# EAGLE schematic MCAT-4CU-B-PPU-V7x-7V2 (EAGLE 6.5.0)
Plasma Power Unit (PPU) V7x [Redrawn from mCAT-V7.pdf] Schematic Version: 1 Date: 8/29/2013 Author: Samudra Haque G19124781 samudra@gwu.edu Project: Micro-Cathode Arc Thruster PhoneSat Experiment Department: Mechanical and Aerospace Engineering (Micropropulsion and Nanotechnology Laboratory) This circuit builds upon the Taisen V7 mCAT with modifications to supply rails and operation with MCAT-3CU-PS3 subsystem. [Note] PPU(V7x) = PPU V7, as-is with conductive polymer aluminum solid capacitor replacement for C1 PPU(V7.2) = PPU V7x, with conductive polymer aluminum solid capactior as replacement for C1, and omission of with RS1, RS2, R1, R4 until further investigation and Switched P15H, Switched P15L, Common Ground operation PPU(V8.1) = Proposed PPU schematic with new IGBT pre-driver (FAN3227TMX); upgraded IGBT protection circuit using fast diodes with high reverse characteristics; current monitoring sensor; modular PCB design TBD
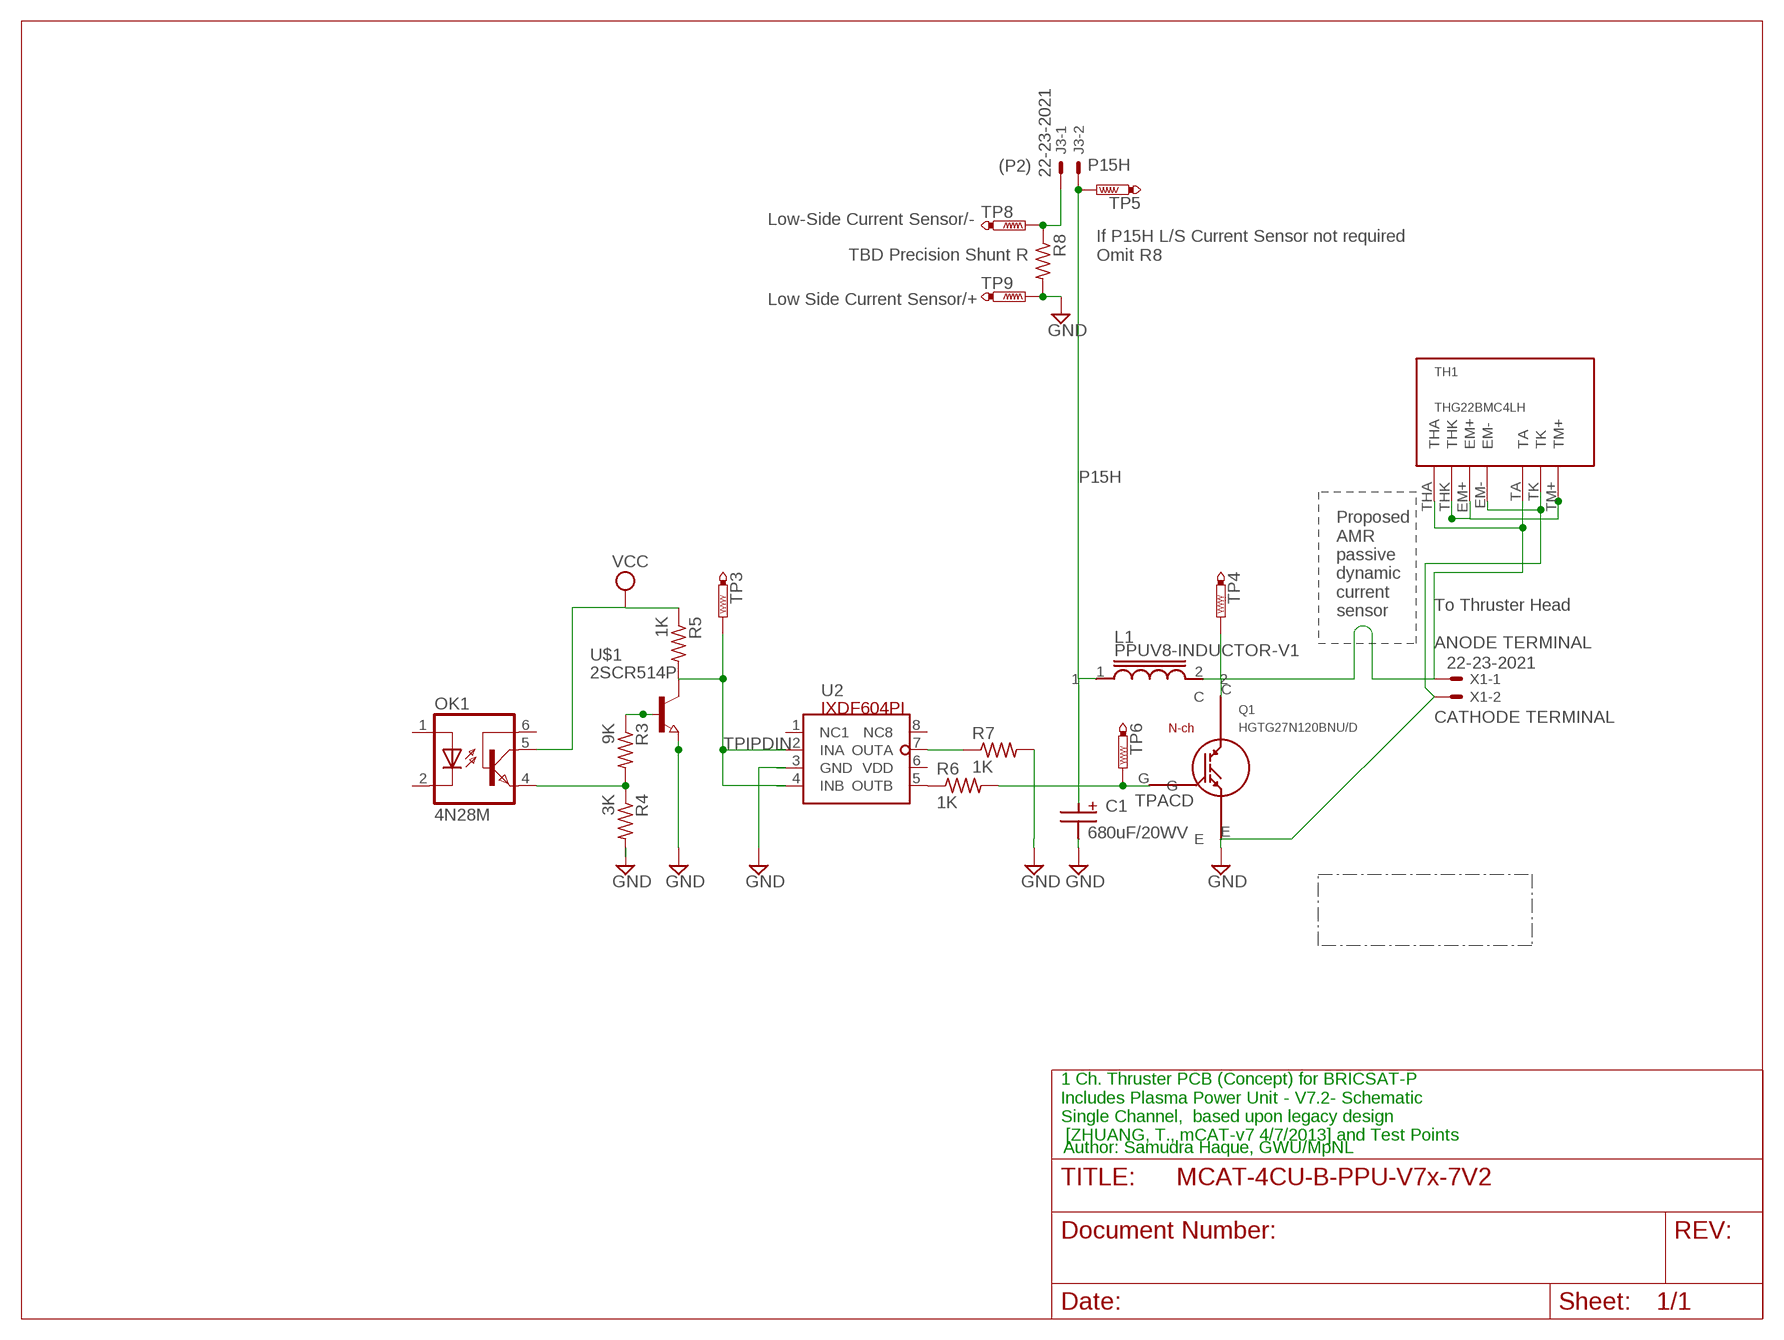
[diagram p0: schematic, sheet 1]

## Parts
C1  680uF/20WV  APSG200ELL681MJB5S  [CHEMI-CON-PSG-JB5]
J3  22-23-2021  [22-23-2021]
L1  PPUV8-INDUCTOR-V1  [PPUV8-INDUCTOR-V1]
OK1  4N28M  [DIL06]
Q1  HGTG27N120BNU/D  [TO-247-FLAT-UD]
R3  9K  R-US_0204/2V  [0204V]
R4  3K  R-US_0204/2V  [0204V]
R5  1K  R-US_0204/2V  [0204V]
R6  1K  R-US_0204/2V  [0204V]
R7  1K  R-US_0204/2V  [0204V]
R8  TBD Precision Shunt R  R-US_0204/2V  [0204V]
TH1  THG22BMC4LH  [TH-G22BMC4-LH]
TP3  PTR1PAD1-20  [P1-20]
TP4  PTR1PAD1-20  [P1-20]
TP5  PTR1PAD1-20  [P1-20]
TP6  PTR1PAD1-20  [P1-20]
TP8  PTR1PAD1-20  [P1-20]
TP9  PTR1PAD1-20  [P1-20]
U2  IXDF604PI  [DIL08]
U$1  2SCR514P  [SOT-89]
X1  22-23-2021  [22-23-2021]

## Nets
GND: C1.NEG(CAP_NEG) Q1.E R4.2 R8.2 TH1.EM- TP9.TP U2.3(GND) U$1.3(E) X1.2
N$1: TH1.EM+ TH1.THK TH1.TM+
N$6: OK1.4(EMI) R3.2 R4.1
N$7: R3.1 U$1.1(B)
N$8: R6.1 U2.5(OUTB)
N$9: R7.1 U2.7(OUTA)
N$10: R7.2
N$12: J3.1 R8.1 TP8.TP
N$13 [V_DC]: L1.2 Q1.C TH1.TA TH1.THA TP4.TP X1.1
P15H: C1.POS(CAP_POS) J3.2 L1.1 TP5.TP
TPACD: Q1.G R6.2 TP6.TP
TPIPDIN: R5.2 TP3.TP U2.2(INA) U2.4(INB) U$1.2(C) U$1.2@1(C)
VCC: OK1.5(COL) R5.1
Unconnected: OK1.1(A) OK1.2(C) OK1.6(BAS) TH1.TK U2.1(NC1) U2.6(VDD) U2.8(NC8)

## Notes on the sheet
- (P2)
- P15H
- Low-Side Current Sensor/-
- If P15H L/S Current Sensor not required
  Omit R8
- Low Side Current Sensor/+
- Proposed
  AMR
  passive
  dynamic
  current
  sensor
- To Thruster Head
  
  ANODE TERMINAL
  
  
  
  CATHODE TERMINAL
- 1 Ch. Thruster PCB (Concept) for BRICSAT-P
  Includes Plasma Power Unit - V7.2- Schematic 
  Single Channel,  based upon legacy design
   [ZHUANG, T., mCAT-v7 4/7/2013] and Test Points
- Author: Samudra Haque, GWU/MpNL

## Library data of the parts
C1 = gwu_mpnl:APSG200ELL681MJB5S
J3 X1 = con-molex:22-23-2021: .100" (2.54mm) Center Header - 2 Pin; MF: MOLEX; MPN: 22-23-2021; OC_FARNELL: 1462926; OC_NEWARK: 25C3832
L1 = gwu_mpnl:PPUV8-INDUCTOR-V1
OK1 = optocoupler:4N*?M: General Purpose 6-Pin Phototransistor Optocouplers Source: http://www.fairchildsemi.com/ds/4N/4N35-M.pdf; MF: FAIRCHILD SEMICONDUCTOR; MPN: 4N28-M; OC_FARNELL: 1504445; OC_NEWARK: 05C3313
Q1 = gwu_mpnl:HGTG27N120BN: HGTG27N120BN 72A, 1200V, NPT Series N-Channel IGBT TO-247 Vertical, Horizontal, Horizontal Upside-Down
R3-R8 = rcl:R-US_: RESISTOR, American symbol
TH1 = mpnl:THG22BMC4
TP3-TP6 TP8 TP9 = testpad:PTR1: TEST PIN
U2 = gwu_mpnl:IXDF604
U$1 = gwu_mpnl:2SCR514P

## Net classes
1 V_DC: width 19.05 mm